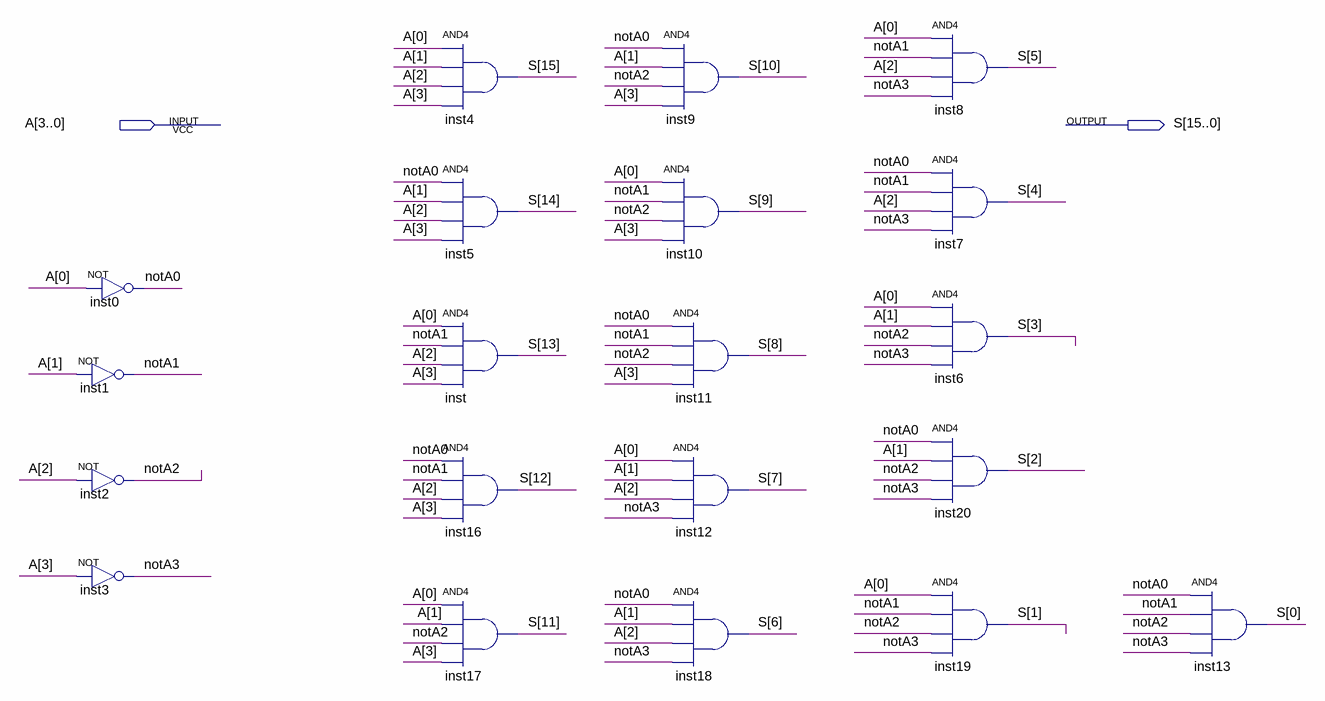
[diagram p0: schematic sheet]
// Quartus schematic DEC.bdf as structural Verilog: 20 symbols, 2 pins
module DEC (
  input  [3:0] A,
  output [15:0] S
);

  wire notA0, notA1, notA2, notA3;

  not inst0 (notA0, A[0]);
  not inst1 (notA1, A[1]);
  not inst2 (notA2, A[2]);
  not inst3 (notA3, A[3]);
  and inst4 (S[15], A[0], A[1], A[2], A[3]);
  and inst5 (S[14], notA0, A[1], A[2], A[3]);
  and inst (S[13], A[0], notA1, A[2], A[3]);
  and inst16 (S[12], notA0, notA1, A[2], A[3]);
  and inst17 (S[11], A[0], A[1], notA2, A[3]);
  and inst9 (S[10], notA0, A[1], notA2, A[3]);
  and inst10 (S[9], A[0], notA1, notA2, A[3]);
  and inst11 (S[8], notA0, notA1, notA2, A[3]);
  and inst12 (S[7], A[0], A[1], A[2], notA3);
  and inst18 (S[6], notA0, A[1], A[2], notA3);
  and inst8 (S[5], A[0], notA1, A[2], notA3);
  and inst7 (S[4], notA0, notA1, A[2], notA3);
  and inst6 (S[3], A[0], A[1], notA2, notA3);
  and inst20 (S[2], notA0, A[1], notA2, notA3);
  and inst19 (S[1], A[0], notA1, notA2, notA3);
  and inst13 (S[0], notA0, notA1, notA2, notA3);
endmodule
